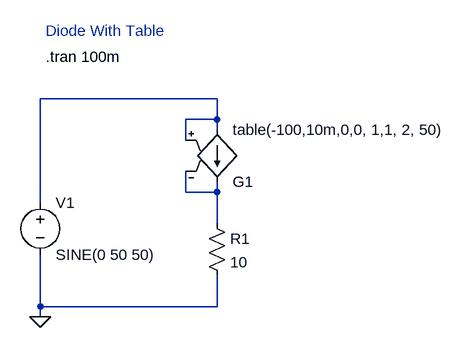
[diagram p0: schematic diode_with_table.asc]
diode_with_table.asc, the LTspice schematic file:
Version 4
SHEET 1 880 680
WIRE 32 96 -240 96
WIRE 32 128 32 96
WIRE 32 128 -16 128
WIRE 32 144 32 128
WIRE -16 160 -16 128
WIRE -16 240 -16 208
WIRE 32 240 32 224
WIRE 32 240 -16 240
WIRE -240 256 -240 96
WIRE 32 288 32 240
WIRE -240 416 -240 336
WIRE 32 416 32 368
WIRE 32 416 -240 416
WIRE -240 432 -240 416
FLAG -240 432 0
SYMBOL g2 32 240 M180
SYMATTR InstName G1
SYMATTR Value table(-100,10m,0,0, 1,1, 2, 50)
SYMBOL voltage -240 240 R0
WINDOW 123 0 0 Left 0
WINDOW 39 0 0 Left 0
SYMATTR InstName V1
SYMATTR Value SINE(0 50 50)
SYMBOL res 16 272 R0
SYMATTR InstName R1
SYMATTR Value 10
TEXT -232 32 Left 0 !.tran 100m
TEXT -232 -8 Left 0 ;Diode With Table

The netlist it stands for:
* diode_with_table.asc
G1 N001 N002 N001 N002 table(-100,10m,0,0, 1,1, 2, 50)
V1 N001 0 SINE(0 50 50)
R1 N002 0 10
.tran 100m
* Diode With Table
.backanno
.end